# Altium schematic sheet BANK34.SchDoc
size A4
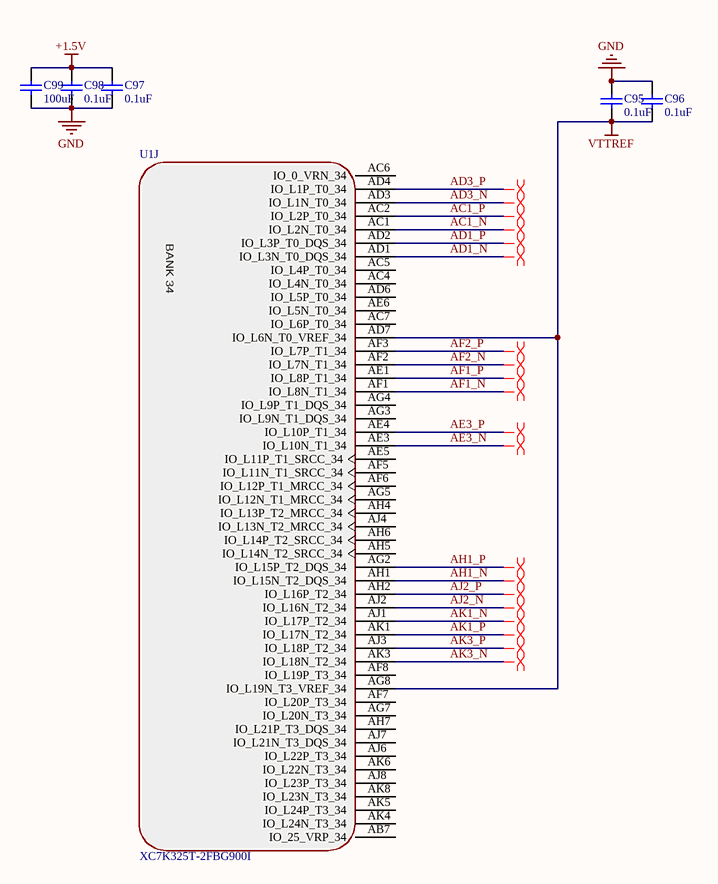
[diagram p0: BANK34.SchDoc]

## Parts
C95  value 0.1uF  [0402]  (hidden comment: Cap Semi)
C96  value 0.1uF  [0402]  (hidden comment: Cap Semi)
C97  value 0.1uF  [0402]  (hidden comment: Cap Semi)
C98  value 0.1uF  [0402]  (hidden comment: Cap Semi)
C99  value 100uF  [0402]  (hidden comment: Cap Semi)
U1  XC7K325T-2FBG900I  (part J of 17)

## Nets
+1.5V: C97.2 C98.2 C99.2
GND: C95.2 C96.2 C97.1 C98.1 C99.1
VTTREF: C95.1 C96.1 U1.AD7(IO_L6N_T0_VREF_34) U1.AG8(IO_L19N_T3_VREF_34)
AC1_N: U1.AC1(IO_L2N_T0_34)
AC1_P: U1.AC2(IO_L2P_T0_34)
AD1_N: U1.AD1(IO_L3N_T0_DQS_34)
AD1_P: U1.AD2(IO_L3P_T0_DQS_34)
AD3_N: U1.AD3(IO_L1N_T0_34)
AD3_P: U1.AD4(IO_L1P_T0_34)
AE3_N: U1.AE3(IO_L10N_T1_34)
AE3_P: U1.AE4(IO_L10P_T1_34)
AF1_N: U1.AF1(IO_L8N_T1_34)
AF1_P: U1.AE1(IO_L8P_T1_34)
AF2_N: U1.AF2(IO_L7N_T1_34)
AF2_P: U1.AF3(IO_L7P_T1_34)
AH1_N: U1.AH1(IO_L15N_T2_DQS_34)
AH1_P: U1.AG2(IO_L15P_T2_DQS_34)
AJ2_N: U1.AJ2(IO_L16N_T2_34)
AJ2_P: U1.AH2(IO_L16P_T2_34)
AK1_N: U1.AJ1(IO_L17P_T2_34)
AK1_P: U1.AK1(IO_L17N_T2_34)
AK3_N: U1.AK3(IO_L18N_T2_34)
AK3_P: U1.AJ3(IO_L18P_T2_34)

Not connected (* = marked no-connect by the designer): U1 AB7(IO_25_VRP_34) AC4(IO_L4N_T0_34) AC5(IO_L4P_T0_34) AC6(IO_0_VRN_34) AC7(IO_L6P_T0_34) AD6(IO_L5P_T0_34) AE5(IO_L11P_T1_SRCC_34) AE6(IO_L5N_T0_34) AF5(IO_L11N_T1_SRCC_34) AF6(IO_L12P_T1_MRCC_34) AF7(IO_L20P_T3_34) AF8(IO_L19P_T3_34) AG3(IO_L9N_T1_DQS_34) AG4(IO_L9P_T1_DQS_34) AG5(IO_L12N_T1_MRCC_34) AG7(IO_L20N_T3_34) AH4(IO_L13P_T2_MRCC_34) AH5(IO_L14N_T2_SRCC_34) AH6(IO_L14P_T2_SRCC_34) AH7(IO_L21P_T3_DQS_34) AJ4(IO_L13N_T2_MRCC_34) AJ6(IO_L22P_T3_34) AJ7(IO_L21N_T3_DQS_34) AJ8(IO_L23P_T3_34) AK4(IO_L24N_T3_34) AK5(IO_L24P_T3_34) AK6(IO_L22N_T3_34) AK8(IO_L23N_T3_34)

## Layout directives
differential pair: AC1_N, AC1_P, AD1_N, AD1_P, AD3_N, AD3_P, AE3_N, AE3_P, AF1_N, AF1_P, AF2_N, AF2_P, AH1_N, AH1_P, AJ2_N, AJ2_P, AK1_N, AK1_P, AK3_N, AK3_P

## Notes on the sheet
- (in symbol XC7K325T-2FBG900I, part J) BANK 34

## Library data of the parts
C95-C99 = Cap Semi: Capacitor (Semiconductor SIM Model); Published: 8-Jun-2000; LatestRevisionDate: 29-May-2009; LatestRevisionNote: IPC-7351 Footprint Added.; PackageReference: C1206; Publisher: Altium Limited; PackageDescription: Chip Capacitor